# Altium project CubeSatBoardTemplate.PrjPcb
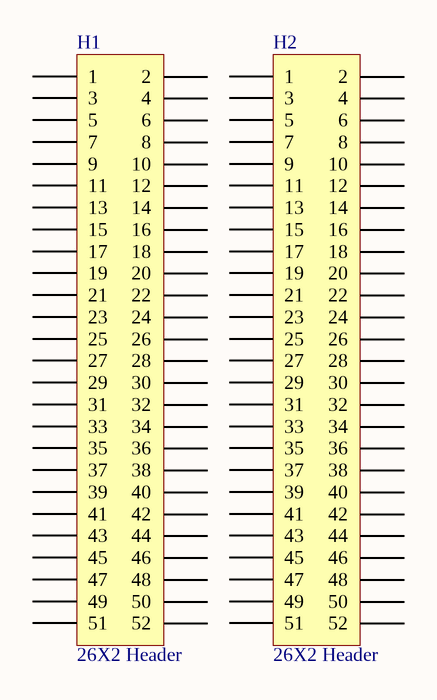
[diagram p0: CubeSatBoardTemplate.SchDoc]
1 sheet, 2 parts. Net scope: global (net labels, ports and power ports of the same name join across sheets).
Board file: CubeSatBoardTemplate.PcbDoc

## Sheet CubeSatBoardTemplate.SchDoc
size 274 x 210 mm

### Parts
H1  26X2 Header  [26X2 Header]
H2  26X2 Header  [26X2 Header]

### Nets

Not connected (* = marked no-connect by the designer): H1 1 2 3 4 5 6 7 8 9 10 11 12 13 14 15 16 17 18 19 20 21 22 23 24 25 26 27 28 29 30 31 32 33 34 35 36 37 38 39 40 41 42 43 44 45 46 47 48 49 50 51 52; H2 1 2 3 4 5 6 7 8 9 10 11 12 13 14 15 16 17 18 19 20 21 22 23 24 25 26 27 28 29 30 31 32 33 34 35 36 37 38 39 40 41 42 43 44 45 46 47 48 49 50 51 52